# Altium project SFCslaver.PrjPCB
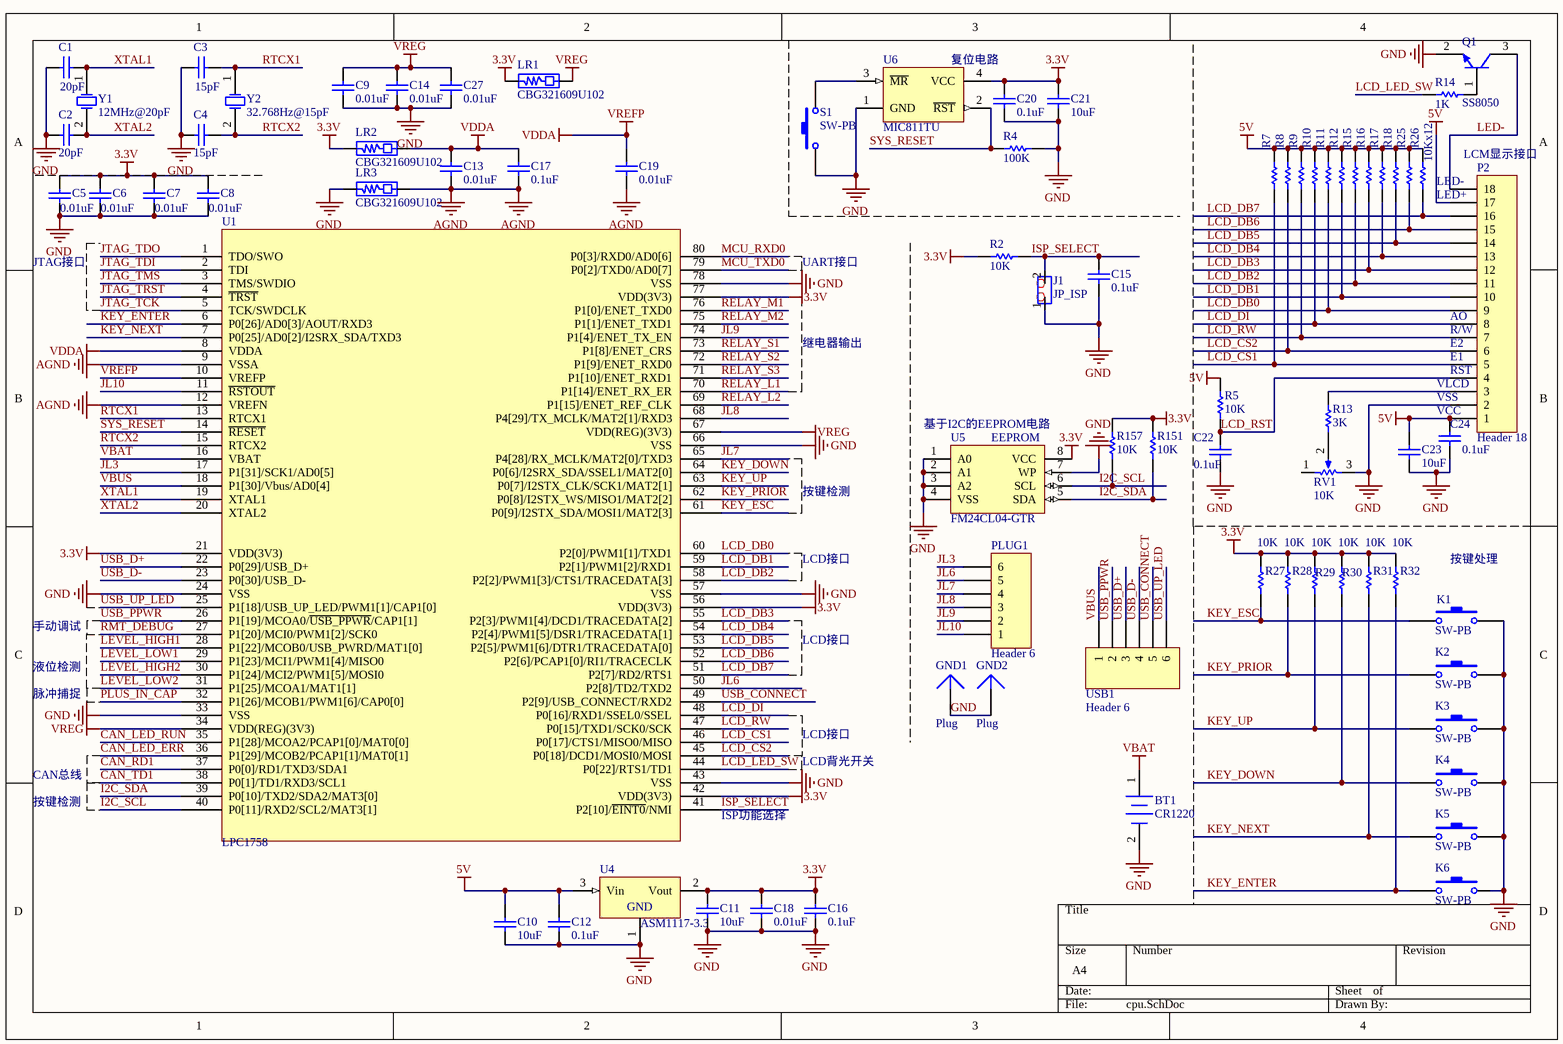
[diagram p0: cpu.SchDoc]
8 sheets, 284 parts. Net scope: global (net labels, ports and power ports of the same name join across sheets).
Board file: JKA-1.PcbDoc
Sheets:
  cpu.SchDoc
  input1.SchDoc
  input2.SchDoc
  input3.SchDoc
  output1.SchDoc
  output2.SchDoc
  output3.SchDoc
  xcomm.SchDoc

## Sheet cpu.SchDoc
size A4

### Parts
BT1  CR1220  [BAT-CR1220A]
C1  20pF  [CAPC2012M]
C2  20pF  [CAPC2012M]
C3  15pF  [CAPC2012M]
C4  15pF  [CAPC2012M]
C5  0.01uF  [CAPC2012M]
C6  0.01uF  [CAPC2012M]
C7  0.01uF  [CAPC2012M]
C8  0.01uF  [CAPC2012M]
C9  0.01uF  [CAPC2012M]
C10  10uF  [CAPC2012M]
C11  10uF  [CAPC2012M]
C12  0.1uF  [CAPC2012M]
C13  0.01uF  [CAPC2012M]
C14  0.01uF  [CAPC2012M]
C15  0.1uF  [CAPC2012M]
C16  0.1uF  [CAPC2012M]
C17  0.1uF  [CAPC2012M]
C18  0.01uF  [CAPC2012M]
C19  0.01uF  [CAPC2012M]
C20  0.1uF  [CAPC2012M]
C21  10uF  [CAPC2012M]
C22  0.1uF  [CAPC2012M]
C23  10uF  [CAPC2012M]
C24  0.1uF  [CAPC2012M]
C27  0.01uF  [CAPC2012M]
GND1  Plug  [PIN1]
GND2  Plug  [PIN1]
J1  JP_ISP  [DS-01]
K1  SW-PB  [PBST-4S]
K2  SW-PB  [PBST-4S]
K3  SW-PB  [PBST-4S]
K4  SW-PB  [PBST-4S]
K5  SW-PB  [PBST-4S]
K6  SW-PB  [PBST-4S]
LR1  CBG321609U102  [RESC3216M]
LR2  CBG321609U102  [RESC3216M]
LR3  CBG321609U102  [RESC3216M]
P2  Header 18  [HDR1X18]
PLUG1  Header 6  [HDR1X6]
Q1  SS8050  [SOT-23_N]
R2  10K  [RESC2012M]
R4  100K  [RESC2012M]
R5  10K  [RESC2012M]
R7  10K  [RESC2012M]  (value not drawn)
R8  10K  [RESC2012M]  (value not drawn)
R9  10K  [RESC2012M]  (value not drawn)
R10  10K  [RESC2012M]  (value not drawn)
R11  10K  [RESC2012M]  (value not drawn)
R12  10K  [RESC2012M]  (value not drawn)
R13  3K  [RESC2012M]
R14  1K  [RESC2012M]
R15  10K  [RESC2012M]  (value not drawn)
R16  10K  [RESC2012M]  (value not drawn)
R17  10K  [RESC2012M]  (value not drawn)
R18  10K  [RESC2012M]  (value not drawn)
R25  10K  [RESC2012M]  (value not drawn)
R26  10K  [RESC2012M]  (value not drawn)
R27  10K  [RESC2012M]
R28  10K  [RESC2012M]
R29  10K  [RESC2012M]
R30  10K  [RESC2012M]
R31  10K  [RESC2012M]
R32  10K  [RESC2012M]
R151  10K  [RESC2012M]
R157  10K  [RESC2012M]
RV1  10K  [VR5S]
S1  SW-PB  [DPST-4S]
U1  LPC1758  [LQFP80_M]
U4  ASM1117-3.3  [SOT-223]
U5  FM24CL04-GTR  [SO-8]
U6  MIC811TU  [SOT143_N]
USB1  Header 6  [HDR1X6]
Y1  12MHz@20pF  [HC_SOC]
Y2  32.768Hz@15pF  [HC-RTC]

### Nets
3.3V: C5.2 C6.2 C7.2 C8.2 C11.2 C16.2 C18.2 C20.2 C21.2 LR1.1 LR2.1 R2.1 R27.2 R28.2 R29.2 R30.2 R31.2 R32.2 R151.2 R157.1 U1.21(VDD(3V3)) U1.42(VDD(3V3)) U1.56(VDD(3V3)) U1.77(VDD(3V3)) U4.2(Vout) U5.8(VCC) U6.4(VCC)
5V: C10.2 C12.2 C23.2 C24.1 P2.1 P2.17 R5.1 R7.1 R8.1 R9.1 R10.1 R11.1 R12.1 R15.1 R16.1 R17.1 R18.1 R25.1 R26.1 U4.3(Vin)
AGND: C13.1 C17.1 C19.1 LR3.2 U1.9(VSSA) U1.12(VREFN)
GND: BT1.2(-) C1.2 C2.2 C3.2 C4.2 C5.1 C6.1 C7.1 C8.1 C9.1 C10.1 C11.1 C12.1 C14.1 C15.2 C16.1 C18.1 C20.1 C21.1 C22.2 C23.1 C24.2 C27.1 GND1.1 GND2.1 J1.1 K1.2 K2.2 K3.2 K4.2 K5.2 K6.2 LR3.1 P2.2 Q1.2(E) R4.2 RV1.3(BOT) S1.1 U1.24(VSS) U1.33(VSS) U1.43(VSS) U1.57(VSS) U1.66(VSS) U1.78(VSS) U4.1(GND) U5.1(A0) U5.2(A1) U5.3(A2) U5.4(VSS) U5.7(WP) U6.1(GND)
VBAT: BT1.1(+) U1.16(VBAT)
VREFP: C13.2 C17.2 C19.2 LR2.2 U1.8(VDDA) U1.10(VREFP)  [also labelled VDDA]
VREG: C9.2 C14.2 C27.2 LR1.2 U1.34(VDD(REG)(3V3)) U1.67(VDD(REG)(3V3))
CAN_LED_ERR: U1.36(P1[29]/MCOB2/PCAP1[1]/MAT0[1])
CAN_LED_RUN: U1.35(P1[28]/MCOA2/PCAP1[0]/MAT0[0])
CAN_RD1: U1.37(P0[0]/RD1/TXD3/SDA1)
CAN_TD1: U1.38(P0[1]/TD1/RXD3/SCL1)
I2C_SCL: R157.2 U1.40(P0[11]/RXD2/SCL2/MAT3[1]) U5.6(SCL)
I2C_SDA: R151.1 U1.39(P0[10]/TXD2/SDA2/MAT3[0]) U5.5(SDA)
ISP_SELECT: C15.1 J1.2 R2.2 U1.41(P2[10]/~{EINT0}/NMI)
JL3: PLUG1.6 U1.17(P1[31]/SCK1/AD0[5])
JL6: PLUG1.5 U1.50(P2[8]/TD2/TXD2)
JL7: PLUG1.4 U1.65(P4[28]/RX_MCLK/MAT2[0]/TXD3)
JL8: PLUG1.3 U1.68(P4[29]/TX_MCLK/MAT2[1]/RXD3)
JL9: PLUG1.2 U1.74(P1[4]/ENET_TX_EN)
JL10: PLUG1.1 U1.11(~{RSTOUT})
JTAG_TCK: U1.5(TCK/SWDCLK)
JTAG_TDI: U1.2(TDI)
JTAG_TDO: U1.1(TDO/SWO)
JTAG_TMS: U1.3(TMS/SWDIO)
JTAG_TRST: U1.4(~{TRST})
KEY_DOWN: K4.1 R30.1 U1.64(P0[6]/I2SRX_SDA/SSEL1/MAT2[0])
KEY_ENTER: K6.1 R32.1 U1.6(P0[26]/AD0[3]/AOUT/RXD3)
KEY_ESC: K1.1 R27.1 U1.61(P0[9]/I2STX_SDA/MOSI1/MAT2[3])
KEY_NEXT: K5.1 R31.1 U1.7(P0[25]/AD0[2]/I2SRX_SDA/TXD3)
KEY_PRIOR: K2.1 R28.1 U1.62(P0[8]/I2STX_WS/MISO1/MAT2[2])
KEY_UP: K3.1 R29.1 U1.63(P0[7]/I2STX_CLK/SCK1/MAT2[1])
LCD_CS1: P2.5 R7.2 U1.46(P0[17]/CTS1/MISO0/MISO)
LCD_CS2: P2.6 R8.2 U1.45(P0[18]/DCD1/MOSI0/MOSI)
LCD_DB0: P2.9 R11.2 U1.60(P2[0]/PWM1[1]/TXD1)
LCD_DB1: P2.10 R12.2 U1.59(P2[1]/PWM1[2]/RXD1)
LCD_DB2: P2.11 R15.2 U1.58(P2[2]/PWM1[3]/CTS1/TRACEDATA[3])
LCD_DB3: P2.12 R16.2 U1.55(P2[3]/PWM1[4]/DCD1/TRACEDATA[2])
LCD_DB4: P2.13 R17.2 U1.54(P2[4]/PWM1[5]/DSR1/TRACEDATA[1])
LCD_DB5: P2.14 R18.2 U1.53(P2[5]/PWM1[6]/DTR1/TRACEDATA[0])
LCD_DB6: P2.15 R25.2 U1.52(P2[6]/PCAP1[0]/RI1/TRACECLK)
LCD_DB7: P2.16 R26.2 U1.51(P2[7]/RD2/RTS1)
LCD_DI: P2.8 R10.2 U1.48(P0[16]/RXD1/SSEL0/SSEL)
LCD_LED_SW: R14.1 U1.44(P0[22]/RTS1/TD1)
LCD_RST: C22.1 P2.4 R5.2
LCD_RW: P2.7 R9.2 U1.47(P0[15]/TXD1/SCK0/SCK)
LED-: P2.18 Q1.3(C)
LEVEL_HIGH1: U1.28(P1[22]/MCOB0/USB_PWRD/MAT1[0])
LEVEL_HIGH2: U1.30(P1[24]/MCI2/PWM1[5]/MOSI0)
LEVEL_LOW1: U1.29(P1[23]/MCI1/PWM1[4]/MISO0)
LEVEL_LOW2: U1.31(P1[25]/MCOA1/MAT1[1])
MCU_RXD0: U1.80(P0[3]/RXD0/AD0[6])
MCU_TXD0: U1.79(P0[2]/TXD0/AD0[7])
PLUS_IN_CAP: U1.32(P1[26]/MCOB1/PWM1[6]/CAP0[0])
RELAY_L1: U1.70(P1[14]/ENET_RX_ER)
RELAY_L2: U1.69(P1[15]/ENET_REF_CLK)
RELAY_M1: U1.76(P1[0]/ENET_TXD0)
RELAY_M2: U1.75(P1[1]/ENET_TXD1)
RELAY_S1: U1.73(P1[8]/ENET_CRS)
RELAY_S2: U1.72(P1[9]/ENET_RXD0)
RELAY_S3: U1.71(P1[10]/ENET_RXD1)
RMT_DEBUG: U1.27(P1[20]/MCI0/PWM1[2]/SCK0)
RTCX1: C3.1 U1.13(RTCX1) Y2.1(OSC1)
RTCX2: C4.1 U1.15(RTCX2) Y2.2(OSC2)
SYS_RESET: R4.1 U1.14(~{RESET}) U6.2(~{RST})
USB_CONNECT: U1.49(P2[9]/USB_CONNECT/RXD2) USB1.5
USB_D+: U1.22(P0[29]/USB_D+) USB1.3
USB_D-: U1.23(P0[30]/USB_D-) USB1.4
USB_PPWR: U1.26(P1[19]/MCOA0/~{USB_PPWR}/CAP1[1]) USB1.2
USB_UP_LED: U1.25(P1[18]/USB_UP_LED/PWM1[1]/CAP1[0]) USB1.6
VBUS: U1.18(P1[30]/Vbus/AD0[4]) USB1.1
XTAL1: C1.1 U1.19(XTAL1) Y1.1(OSC1)
XTAL2: C2.1 U1.20(XTAL2) Y1.2(OSC2)
NetP2_3: P2.3 R13.2
NetQ1_1: Q1.1(B) R14.2
NetR13_1: R13.1 RV1.2(TAP)
NetS1_2: S1.2 U6.3(~{MR})

Not connected (* = marked no-connect by the designer): RV1 1(TOP)

### Notes on the sheet
- (near U6) 复位电路
- LED-
- (near R26) 10Kx12
- LCM显示接口
- LED+
- JTAG接口
- UART接口
- (near P2) AO
- 继电器输出
- (near P2) VLCD
- (near P2) R/W
- (near P2) E1
- (near P2) E2
- (near P2) RST
- (near U5) 基于I2C的EEPROM电路
- (near U5) EEPROM
- VSS
- VCC
- 按键检测
- LCD接口
- 按键处理
- 手动调试
- 脉冲捕捉
- 液位检测
- CAN总线
- LCD背光开关
- (near U1) ISP功能选择

### Library data of the parts
BT1 = Battery: Battery holder; Published: 24-Mar-1999; LatestRevisionDate: 17-Jul-2002; LatestRevisionNote: Re-released for DXP Platform.; PackageReference: BAT-2; Publisher: Altium Limited
C1-C4 = Cap: Capacitor; Value: 100pF; Published: 8-Jun-2000; LatestRevisionDate: 17-Jul-2002; LatestRevisionNote: Re-released for DXP Platform.; PackageReference: RAD-0.3; Publisher: Altium Limited
C5-C24 C27 = Cap: Capacitor; Value: 1nF; Published: 8-Jun-2000; LatestRevisionDate: 17-Jul-2002; LatestRevisionNote: Re-released for DXP Platform.; PackageReference: RAD-0.3; Publisher: Altium Limited
J1 = JK2H: Dial Switch pitch 7.62mm
K1-K6 = SW-PB: Push Button ,6mm(L)x6mm(W)x22mm(H); Published: 24-Mar-1999; LatestRevisionDate: 17-Jul-2002; LatestRevisionNote: Re-released for DXP Platform.; PackageReference: SPST-2; Publisher: Altium Limited
LR1-LR3 = BLM10/11/21/31/41: EMI FILTERS,DC Resistance max.0.05~1.5 ohms,10 ~ 1000 ohms at 100MHz  Frequency
P2 = Header 18H: 'Female Header,Single Row Straight, 20-Pin,Pitch 2.54mm,black; LatestRevisionDate: 17-Jul-2002; LatestRevisionNote: Re-released for DXP Platform.; Publisher: Altium Limited
PLUG1 USB1 = Header 6: Header, 6-Pin; LatestRevisionDate: 17-Jul-2002; LatestRevisionNote: Re-released for DXP Platform.; Publisher: Altium Limited
Q1 = PMMT491A: NPN BISS Transistor; Published: 17-Sep-2003; LatestRevisionDate: 12-Dec-2006; LatestRevisionNote: IPC-7351 Footprint Added.; DatasheetVersion: 11-Jun-2001; PackageVersion: May-1999; PackageReference: SOT23; Publisher: Altium Limited; PackageDescription: 3-Pin SOT-23 Package 0.95 mm Pitch, 2.3 mm Lead Span; ComponentLink1Description: Manufacturer Link; ComponentLink1URL: http://www.semiconductors.philips.com/; ComponentLink2Description: Datasheet; ComponentLink2URL: http://www.semiconductors.philips.com/acrobat/datasheets/PMMT491A_5.pdf
R2 R5 R7-R12 R15-R18 R25-R32 R151 R157 = Res1: Resistor; Published: 8-Jun-2000; LatestRevisionDate: 17-Jul-2002; LatestRevisionNote: Re-released for DXP Platform.; PackageReference: AXIAL-0.3; Publisher: Altium Limited; Value: 10K
R4 R13 R14 = Res1: Resistor; Value: 10K; Published: 8-Jun-2000; LatestRevisionDate: 17-Jul-2002; LatestRevisionNote: Re-released for DXP Platform.; PackageReference: AXIAL-0.3; Publisher: Altium Limited
RV1 = RPot-A: Potentiometer; Sim Note: Enter the Resistance value and the set point into parameter fields.; Set Position: 0.5; Value: 1K; Published: 8-Jun-2000; LatestRevisionDate: 17-Jul-2002; LatestRevisionNote: Re-released for DXP Platform.; PackageReference: VR5; Publisher: Altium Limited
S1 = SW-PB: Push Button ,2mm(L)x2mm(W)x10mm(H); Published: 24-Mar-1999; LatestRevisionDate: 17-Jul-2002; LatestRevisionNote: Re-released for DXP Platform.; PackageReference: SPST-2; Publisher: Altium Limited
U4 = LM1117T-5.0: 800mA Low-Dropout Linear Regulator
U5 = CAT24W02: Serial EEPROM
U6 = MAX811-EUS-T: 4-Pin 礟 Voltage Monitors with Manual Reset Input; Published: 16-Jan-2001; LatestRevisionDate: 29-May-2009; LatestRevisionNote: IPC-7351 Footprint Added.; DatasheetVersion: Feb-1998; PackageVersion: Feb-1998; PackageReference: SOT143; Publisher: Altium Limited; PackageDescription: 4-Pin SOT-143 Package 1.9 mm Pitch, 2.3 mm Lead Span; ComponentLink1Description: Manufacturer Link; ComponentLink1URL: http://www.maxim-ic.com/; ComponentLink2Description: Datasheet; ComponentLink2URL: http://pdfserv.maxim-ic.com/en/ds/MAX811-MAX812.pdf
Y1 Y2 = XTAL: Crystal Oscillator; Published: 8-Jun-2000; LatestRevisionDate: 17-Jul-2002; LatestRevisionNote: Re-released for DXP Platform.; PackageReference: R38; Publisher: Altium Limited
GND1 GND2 = Plug: LatestRevisionDate: 17-Jul-2002; LatestRevisionNote: Re-released for DXP Platform.; Publisher: Altium Limited

## Sheet input1.SchDoc
size A4
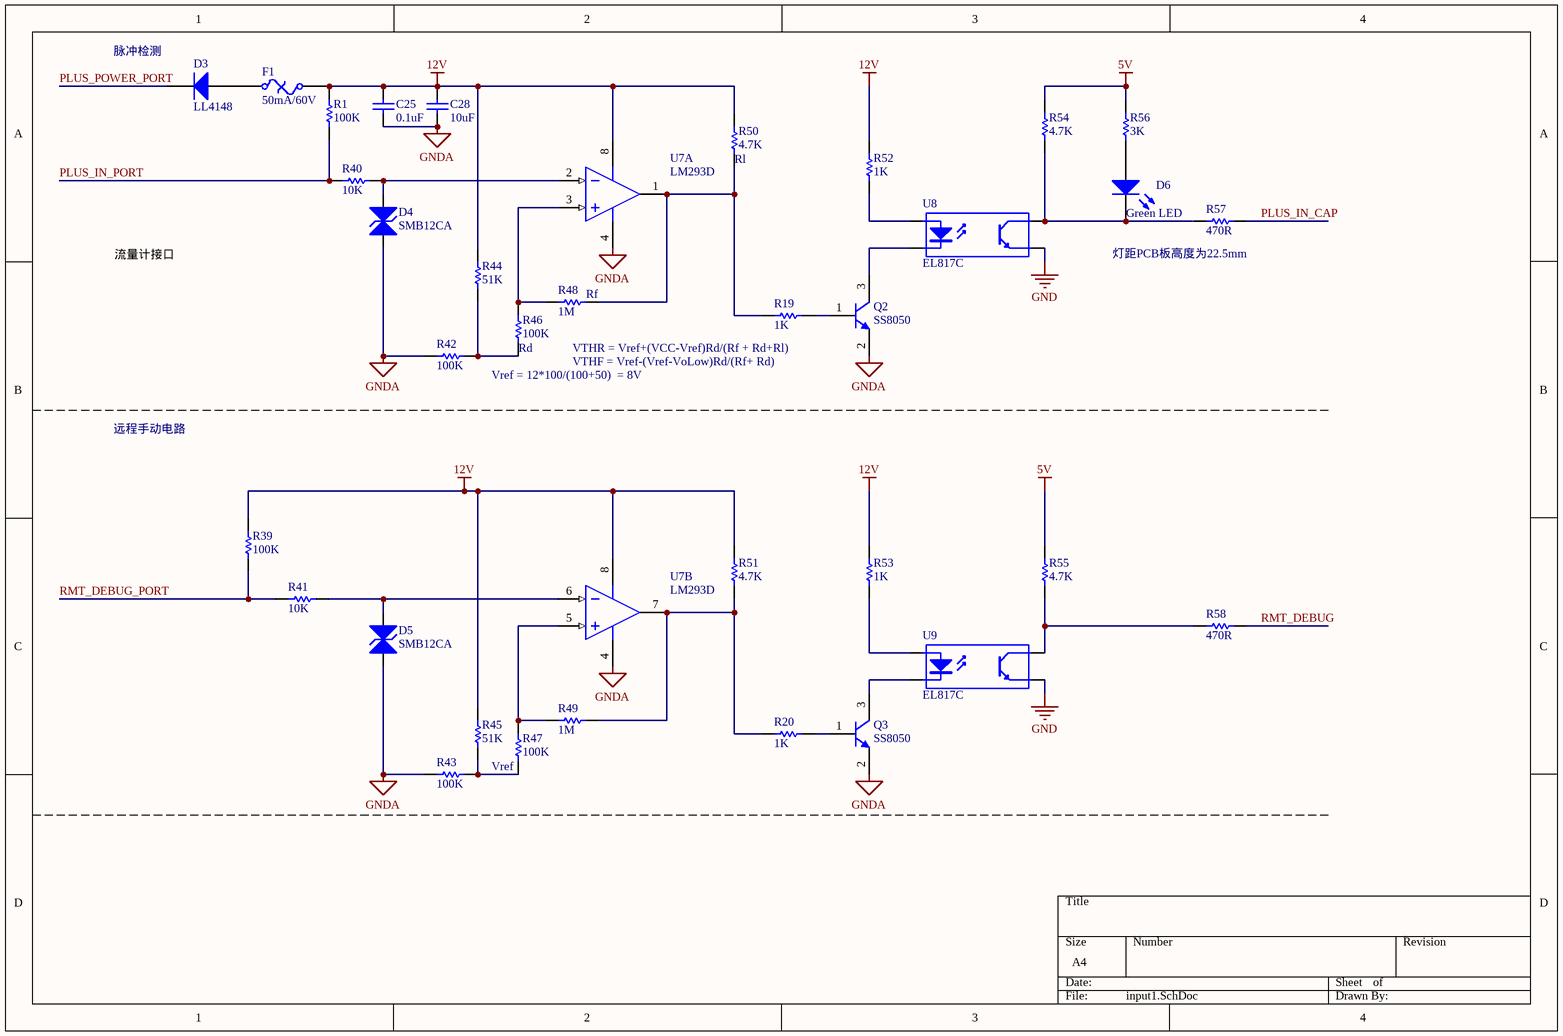
[diagram p1: input1.SchDoc]

### Parts
C25  0.1uF  [CAPC2012M]
C28  10uF  [CAPC2012M]
D3  LL4148  [CD3216-1206]
D4  SMB12CA  [SMB]
D5  SMB12CA  [SMB]
D6  Green LED  [LED254A]
F1  50mA/60V  [RESC3216M]
Q2  SS8050  [SOT-23_N]
Q3  SS8050  [SOT-23_N]
R1  100K  [RESC2012M]
R19  1K  [RESC2012M]
R20  1K  [RESC2012M]
R39  100K  [RESC2012M]
R40  10K  [RESC2012M]
R41  10K  [RESC2012M]
R42  100K  [RESC2012M]
R43  100K  [RESC2012M]
R44  51K  [RESC2012M]
R45  51K  [RESC2012M]
R46  100K  [RESC2012M]
R47  100K  [RESC2012M]
R48  1M  [RESC2012M]
R49  1M  [RESC2012M]
R50  4.7K  [RESC2012M]
R51  4.7K  [RESC2012M]
R52  1K  [RESC2012M]
R53  1K  [RESC2012M]
R54  4.7K  [RESC2012M]
R55  4.7K  [RESC2012M]
R56  3K  [RESC2012M]
R57  470R  [RESC2012M]
R58  470R  [RESC2012M]
U7  LM293D  [SO8_N]  (parts A,B of 2)
U8  EL817C  [SO-4LA]
U9  EL817C  [SO-4LA]

### Nets
5V: R54.2 R55.2 R56.1
12V: C25.2 C28.2 F1.2 R1.2 R39.2 R44.2 R45.2 R50.1 R51.2 R52.1 R53.1 U7.8(V+)
GND: U8.3(E) U9.3(E)
GNDA: C25.1 C28.1 D4.1(A) D5.1(A) Q2.2(E) Q3.2(E) R42.1 R43.1 U7.4(V-)
PLUS_IN_CAP: R57.2
PLUS_IN_PORT: R1.1 R40.2
PLUS_POWER_PORT: D3.2(K)
RMT_DEBUG: R58.2
RMT_DEBUG_PORT: R39.1 R41.2
NetD3_1: D3.1(A) F1.1
NetD4_2: D4.2(K) R40.1 U7.2(IN-)
NetD5_2: D5.2(K) R41.1 U7.6(IN-)
NetD6_1: D6.1(A) R56.2
NetD6_2: D6.2(K) R54.1 R57.1 U8.4(C)
NetQ2_1: Q2.1(B) R19.2
NetQ2_3: Q2.3(C) U8.2(K)
NetQ3_1: Q3.1(B) R20.2
NetQ3_3: Q3.3(C) U9.2(K)
NetR19_1: R19.1 R48.1 R50.2 U7.1(OUT)
NetR20_1: R20.1 R49.2 R51.1 U7.7(OUT)
NetR42_2: R42.2 R44.1 R46.1
NetR43_2: R43.2 R45.1 R47.1
NetR46_2: R46.2 R48.2 U7.3(IN+)
NetR47_2: R47.2 R49.1 U7.5(IN+)
NetR52_2: R52.2 U8.1(A)
NetR53_2: R53.2 U9.1(A)
NetR55_1: R55.1 R58.1 U9.4(C)

### Notes on the sheet
- 脉冲检测
- (near R50) Rl
- 流量计接口
- (near R48) Rf
- (near R57) 灯距PCB板高度为22.5mm
- Vref = 12*100/(100+50)  = 8V
- (near R46) Rd
- VTHR = Vref+(VCC-Vref)Rd/(Rf + Rd+Rl)
- VTHF = Vref-(Vref-VoLow)Rd/(Rf+ Rd)
- 远程手动电路
- (near R47) Vref

### Library data of the parts
C25 C28 = Cap: Capacitor; Value: 1nF; Published: 8-Jun-2000; LatestRevisionDate: 17-Jul-2002; LatestRevisionNote: Re-released for DXP Platform.; PackageReference: RAD-0.3; Publisher: Altium Limited
D3 = Diode 1N4007: 1 Amp General Purpose Rectifier; Published: 8-Jun-2000; LatestRevisionDate: 17-Jul-2002; LatestRevisionNote: Re-released for DXP Platform.; DatasheetVersion: 1998; PackageVersion: Aug-1999; PackageReference: DO-41; Publisher: Altium Limited; Code_JEDEC: DO-204-AL; ComponentLink1Description: Manufacturer Link; ComponentLink1URL: http://www.fairchildsemi.com/; ComponentLink2Description: Datasheet; ComponentLink2URL: http://www.fairchildsemi.com/ds/1N%2F1N4001.pdf
D4 D5 = Bi-dir TVS Diode: Published: 8-Jun-2000; LatestRevisionDate: 17-Jul-2002; LatestRevisionNote: Re-released for DXP Platform.; PackageReference: DIODE-0.7; Publisher: Altium Limited
D6 = LED1: Green LED ,SIP, Dia =3mm; Published: 8-Jun-2000; LatestRevisionDate: 08-Jul-2005; LatestRevisionNote: Mech Layer 1 removed.; PackageReference: LED-1; Publisher: Altium Limited
F1 = Fuse Thermal: Thermal Fuse; Published: 24-Mar-1999; LatestRevisionDate: 17-Jul-2002; LatestRevisionNote: Re-released for DXP Platform.; PackageReference: PIN-W2/E2.8; Publisher: Altium Limited; PackageDescription: Thru-Hole; 2 Leads
Q2 Q3 = PMMT491A: NPN BISS Transistor; Published: 17-Sep-2003; LatestRevisionDate: 12-Dec-2006; LatestRevisionNote: IPC-7351 Footprint Added.; DatasheetVersion: 11-Jun-2001; PackageVersion: May-1999; PackageReference: SOT23; Publisher: Altium Limited; PackageDescription: 3-Pin SOT-23 Package 0.95 mm Pitch, 2.3 mm Lead Span; ComponentLink1Description: Manufacturer Link; ComponentLink1URL: http://www.semiconductors.philips.com/; ComponentLink2Description: Datasheet; ComponentLink2URL: http://www.semiconductors.philips.com/acrobat/datasheets/PMMT491A_5.pdf
R1 R19 R20 R39 R42-R57 = Res1: Resistor; Value: 10K; Published: 8-Jun-2000; LatestRevisionDate: 17-Jul-2002; LatestRevisionNote: Re-released for DXP Platform.; PackageReference: AXIAL-0.3; Publisher: Altium Limited
R40 R41 = Res1: Resistor; Published: 8-Jun-2000; LatestRevisionDate: 17-Jul-2002; LatestRevisionNote: Re-released for DXP Platform.; PackageReference: AXIAL-0.3; Publisher: Altium Limited; Value: 10K
R58 = Res1: Resistor; Value: 470; Published: 8-Jun-2000; LatestRevisionDate: 17-Jul-2002; LatestRevisionNote: Re-released for DXP Platform.; PackageReference: AXIAL-0.3; Publisher: Altium Limited
U7 = LM393AD: Low-Power Dual Voltage Comparator; Published: 24-Aug-2001; LatestRevisionDate: 13-Apr-2006; LatestRevisionNote: IPC-7351 Footprint Added.; DatasheetVersion: Nov-1992; PackageVersion: Dec-2002; PackageReference: SO8; Publisher: Altium Limited; PackageDescription: 8-Pin Small Outline Integrated Circuit 1.27 mm Pitch; Code_JEDEC: MS-012-AA; Code_IPC: SOIC127P600-8; ComponentLink1Description: Manufacturer Link; ComponentLink1URL: http://www.st.com/; ComponentLink2Description: Datasheet; ComponentLink2URL: http://www.st.com/stonline/products/literature/ds/2164/lm193.pdf
U8 U9 = Optoisolator1: 4-Pin Phototransistor Optocoupler; Published: 24-Mar-1999; LatestRevisionDate: 04-Mar-2005; LatestRevisionNote: Sch pins 3 & 4 Swapped.; DatasheetVersion: Nov-2003; PackageReference: DIP-4; Publisher: Altium Limited

## Sheet input2.SchDoc
size A4
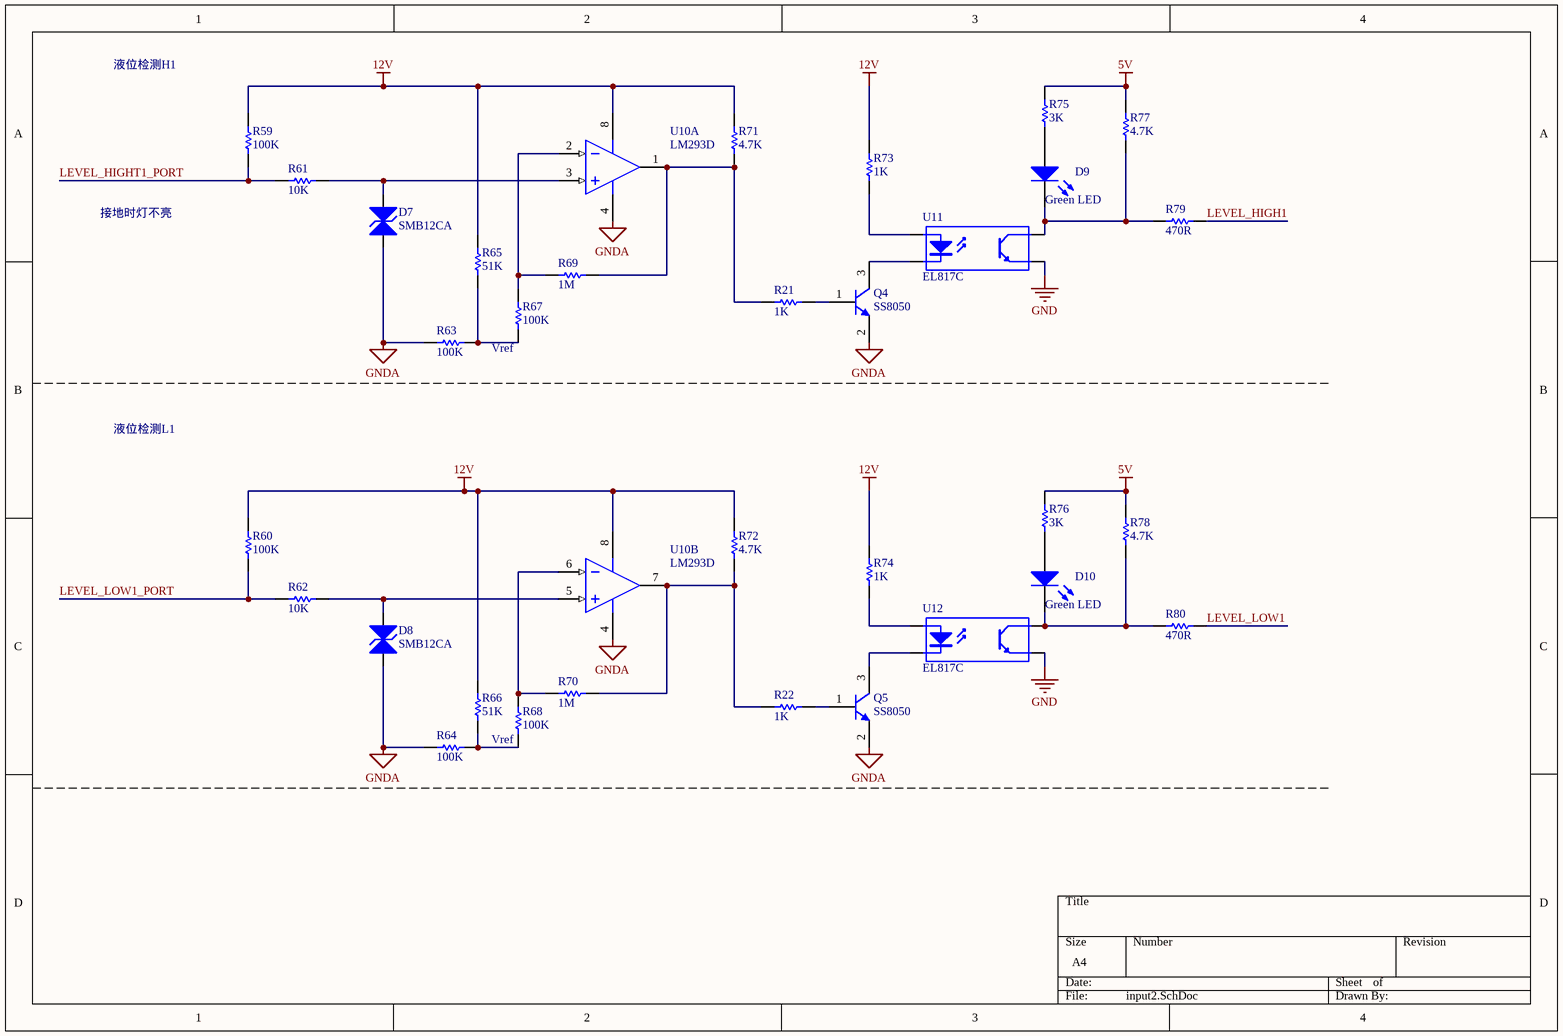
[diagram p2: input2.SchDoc]

### Parts
D7  SMB12CA  [SMB]
D8  SMB12CA  [SMB]
D9  Green LED  [LED254A]
D10  Green LED  [LED254A]
Q4  SS8050  [SOT-23_N]
Q5  SS8050  [SOT-23_N]
R21  1K  [RESC2012M]
R22  1K  [RESC2012M]
R59  100K  [RESC2012M]
R60  100K  [RESC2012M]
R61  10K  [RESC2012M]
R62  10K  [RESC2012M]
R63  100K  [RESC2012M]
R64  100K  [RESC2012M]
R65  51K  [RESC2012M]
R66  51K  [RESC2012M]
R67  100K  [RESC2012M]
R68  100K  [RESC2012M]
R69  1M  [RESC2012M]
R70  1M  [RESC2012M]
R71  4.7K  [RESC2012M]
R72  4.7K  [RESC2012M]
R73  1K  [RESC2012M]
R74  1K  [RESC2012M]
R75  3K  [RESC2012M]
R76  3K  [RESC2012M]
R77  4.7K  [RESC2012M]
R78  4.7K  [RESC2012M]
R79  470R  [RESC2012M]
R80  470R  [RESC2012M]
U10  LM293D  [SO8_N]  (parts A,B of 2)
U11  EL817C  [SO-4LA]
U12  EL817C  [SO-4LA]

### Nets
5V: R75.1 R76.1 R77.2 R78.2
12V: R59.2 R60.2 R65.2 R66.2 R71.1 R72.2 R73.2 R74.1 U10.8(V+)
GND: U11.3(E) U12.3(E)
GNDA: D7.1(A) D8.1(A) Q4.2(E) Q5.2(E) R63.1 R64.1 U10.4(V-)
LEVEL_HIGH1: R79.2
LEVEL_HIGHT1_PORT: R59.1 R61.2
LEVEL_LOW1: R80.2
LEVEL_LOW1_PORT: R60.1 R62.2
NetD7_2: D7.2(K) R61.1 U10.3(IN+)
NetD8_2: D8.2(K) R62.1 U10.5(IN+)
NetD9_1: D9.1(A) R75.2
NetD9_2: D9.2(K) R77.1 R79.1 U11.4(C)
NetD10_1: D10.1(A) R76.2
NetD10_2: D10.2(K) R78.1 R80.1 U12.4(C)
NetQ4_1: Q4.1(B) R21.2
NetQ4_3: Q4.3(C) U11.2(K)
NetQ5_1: Q5.1(B) R22.2
NetQ5_3: Q5.3(C) U12.2(K)
NetR21_1: R21.1 R69.2 R71.2 U10.1(OUT)
NetR22_1: R22.1 R70.2 R72.1 U10.7(OUT)
NetR63_2: R63.2 R65.1 R67.2
NetR64_2: R64.2 R66.1 R68.1
NetR67_1: R67.1 R69.1 U10.2(IN-)
NetR68_2: R68.2 R70.1 U10.6(IN-)
NetR73_1: R73.1 U11.1(A)
NetR74_2: R74.2 U12.1(A)

### Notes on the sheet
- 液位检测H1
- 接地时灯不亮
- (near R67) Vref
- 液位检测L1
- (near R68) Vref

### Library data of the parts
D7 D8 = Bi-dir TVS Diode: Published: 8-Jun-2000; LatestRevisionDate: 17-Jul-2002; LatestRevisionNote: Re-released for DXP Platform.; PackageReference: DIODE-0.7; Publisher: Altium Limited
D9 D10 = LED1: Green LED ,SIP, Dia =3mm; Published: 8-Jun-2000; LatestRevisionDate: 08-Jul-2005; LatestRevisionNote: Mech Layer 1 removed.; PackageReference: LED-1; Publisher: Altium Limited
Q4 Q5 = PMMT491A: NPN BISS Transistor; Published: 17-Sep-2003; LatestRevisionDate: 12-Dec-2006; LatestRevisionNote: IPC-7351 Footprint Added.; DatasheetVersion: 11-Jun-2001; PackageVersion: May-1999; PackageReference: SOT23; Publisher: Altium Limited; PackageDescription: 3-Pin SOT-23 Package 0.95 mm Pitch, 2.3 mm Lead Span; ComponentLink1Description: Manufacturer Link; ComponentLink1URL: http://www.semiconductors.philips.com/; ComponentLink2Description: Datasheet; ComponentLink2URL: http://www.semiconductors.philips.com/acrobat/datasheets/PMMT491A_5.pdf
R21 R22 R59 R60 R63-R80 = Res1: Resistor; Value: 10K; Published: 8-Jun-2000; LatestRevisionDate: 17-Jul-2002; LatestRevisionNote: Re-released for DXP Platform.; PackageReference: AXIAL-0.3; Publisher: Altium Limited
R61 R62 = Res1: Resistor; Published: 8-Jun-2000; LatestRevisionDate: 17-Jul-2002; LatestRevisionNote: Re-released for DXP Platform.; PackageReference: AXIAL-0.3; Publisher: Altium Limited; Value: 10K
U10 = LM393AD: Low-Power Dual Voltage Comparator; Published: 24-Aug-2001; LatestRevisionDate: 13-Apr-2006; LatestRevisionNote: IPC-7351 Footprint Added.; DatasheetVersion: Nov-1992; PackageVersion: Dec-2002; PackageReference: SO8; Publisher: Altium Limited; PackageDescription: 8-Pin Small Outline Integrated Circuit 1.27 mm Pitch; Code_JEDEC: MS-012-AA; Code_IPC: SOIC127P600-8; ComponentLink1Description: Manufacturer Link; ComponentLink1URL: http://www.st.com/; ComponentLink2Description: Datasheet; ComponentLink2URL: http://www.st.com/stonline/products/literature/ds/2164/lm193.pdf
U11 U12 = Optoisolator1: 4-Pin Phototransistor Optocoupler; Published: 24-Mar-1999; LatestRevisionDate: 04-Mar-2005; LatestRevisionNote: Sch pins 3 & 4 Swapped.; DatasheetVersion: Nov-2003; PackageReference: DIP-4; Publisher: Altium Limited

## Sheet input3.SchDoc
size A4
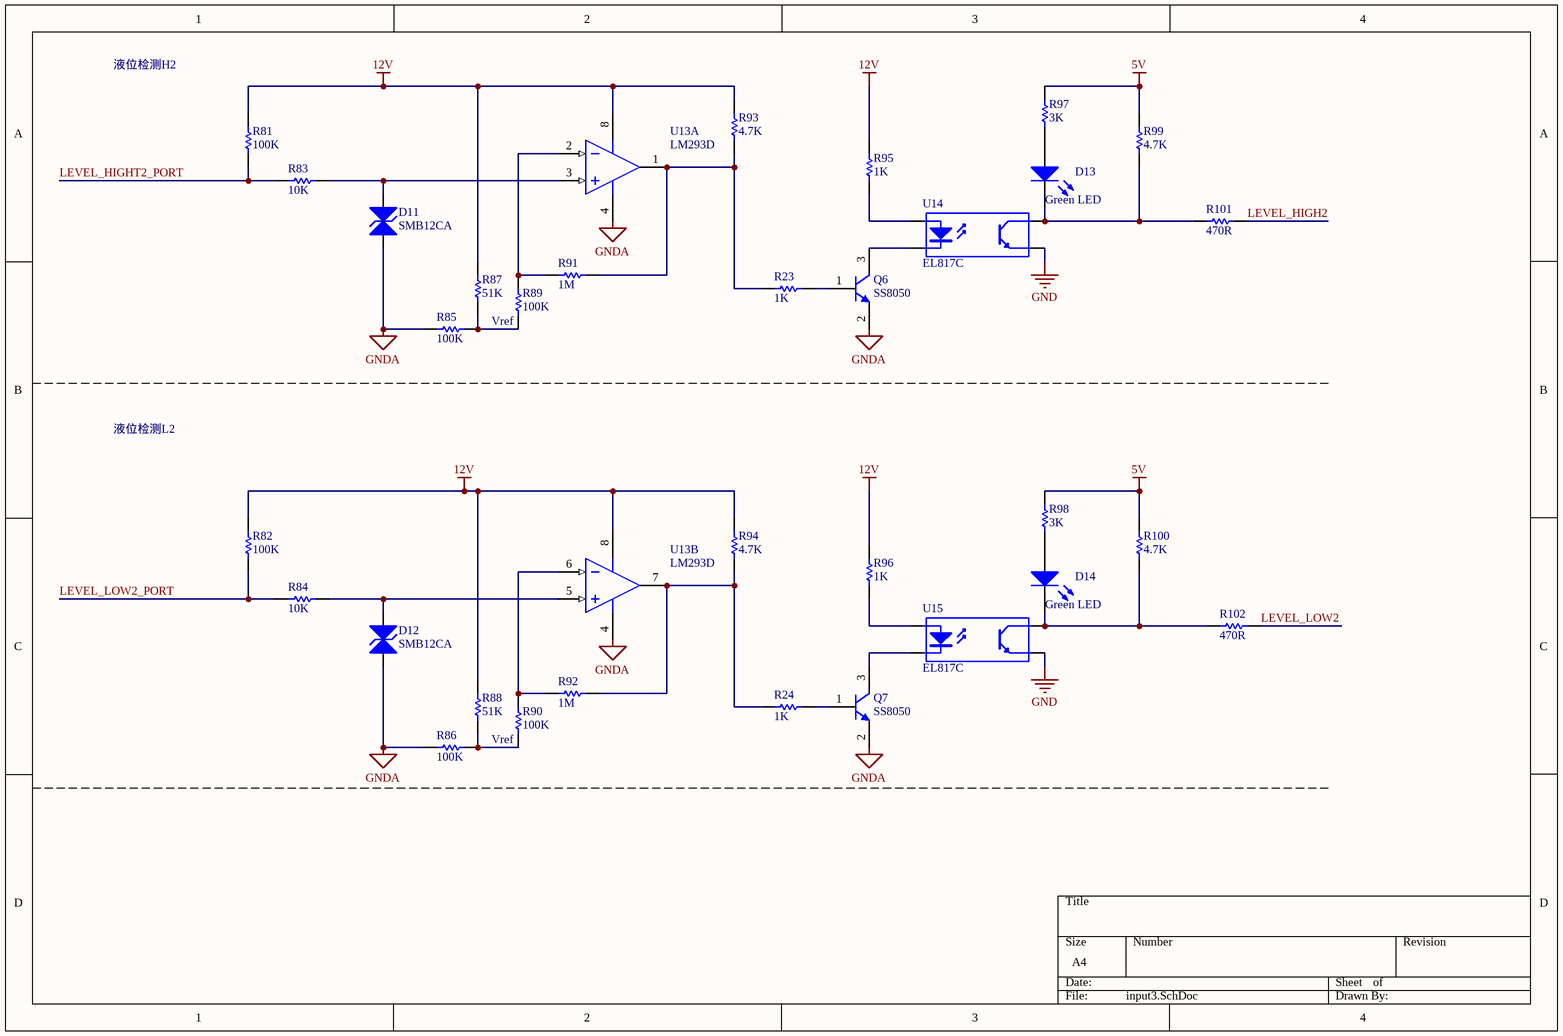
[diagram p3: input3.SchDoc]

### Parts
D11  SMB12CA  [SMB]
D12  SMB12CA  [SMB]
D13  Green LED  [LED254A]
D14  Green LED  [LED254A]
Q6  SS8050  [SOT-23_N]
Q7  SS8050  [SOT-23_N]
R23  1K  [RESC2012M]
R24  1K  [RESC2012M]
R81  100K  [RESC2012M]
R82  100K  [RESC2012M]
R83  10K  [RESC2012M]
R84  10K  [RESC2012M]
R85  100K  [RESC2012M]
R86  100K  [RESC2012M]
R87  51K  [RESC2012M]
R88  51K  [RESC2012M]
R89  100K  [RESC2012M]
R90  100K  [RESC2012M]
R91  1M  [RESC2012M]
R92  1M  [RESC2012M]
R93  4.7K  [RESC2012M]
R94  4.7K  [RESC2012M]
R95  1K  [RESC2012M]
R96  1K  [RESC2012M]
R97  3K  [RESC2012M]
R98  3K  [RESC2012M]
R99  4.7K  [RESC2012M]
R100  4.7K  [RESC2012M]
R101  470R  [RESC2012M]
R102  470R  [RESC2012M]
U13  LM293D  [SO8_N]  (parts A,B of 2)
U14  EL817C  [SO-4LA]
U15  EL817C  [SO-4LA]

### Nets
5V: R97.1 R98.1 R99.2 R100.2
12V: R81.2 R82.2 R87.2 R88.2 R93.1 R94.2 R95.1 R96.1 U13.8(V+)
GND: U14.3(E) U15.3(E)
GNDA: D11.1(A) D12.1(A) Q6.2(E) Q7.2(E) R85.1 R86.1 U13.4(V-)
LEVEL_HIGH2: R101.2
LEVEL_HIGHT2_PORT: R81.1 R83.2
LEVEL_LOW2: R102.2
LEVEL_LOW2_PORT: R82.1 R84.2
NetD11_2: D11.2(K) R83.1 U13.3(IN+)
NetD12_2: D12.2(K) R84.1 U13.5(IN+)
NetD13_1: D13.1(A) R97.2
NetD13_2: D13.2(K) R99.1 R101.1 U14.4(C)
NetD14_1: D14.1(A) R98.2
NetD14_2: D14.2(K) R100.1 R102.1 U15.4(C)
NetQ6_1: Q6.1(B) R23.2
NetQ6_3: Q6.3(C) U14.2(K)
NetQ7_1: Q7.1(B) R24.2
NetQ7_3: Q7.3(C) U15.2(K)
NetR23_1: R23.1 R91.2 R93.2 U13.1(OUT)
NetR24_1: R24.1 R92.2 R94.1 U13.7(OUT)
NetR85_2: R85.2 R87.1 R89.2
NetR86_2: R86.2 R88.1 R90.1
NetR89_1: R89.1 R91.1 U13.2(IN-)
NetR90_2: R90.2 R92.1 U13.6(IN-)
NetR95_2: R95.2 U14.1(A)
NetR96_2: R96.2 U15.1(A)

### Notes on the sheet
- 液位检测H2
- (near R89) Vref
- 液位检测L2
- (near R90) Vref

### Library data of the parts
D11 D12 = Bi-dir TVS Diode: Published: 8-Jun-2000; LatestRevisionDate: 17-Jul-2002; LatestRevisionNote: Re-released for DXP Platform.; PackageReference: DIODE-0.7; Publisher: Altium Limited
D13 D14 = LED1: Green LED ,SIP, Dia =3mm; Published: 8-Jun-2000; LatestRevisionDate: 08-Jul-2005; LatestRevisionNote: Mech Layer 1 removed.; PackageReference: LED-1; Publisher: Altium Limited
Q6 Q7 = PMMT491A: NPN BISS Transistor; Published: 17-Sep-2003; LatestRevisionDate: 12-Dec-2006; LatestRevisionNote: IPC-7351 Footprint Added.; DatasheetVersion: 11-Jun-2001; PackageVersion: May-1999; PackageReference: SOT23; Publisher: Altium Limited; PackageDescription: 3-Pin SOT-23 Package 0.95 mm Pitch, 2.3 mm Lead Span; ComponentLink1Description: Manufacturer Link; ComponentLink1URL: http://www.semiconductors.philips.com/; ComponentLink2Description: Datasheet; ComponentLink2URL: http://www.semiconductors.philips.com/acrobat/datasheets/PMMT491A_5.pdf
R23 R24 R81 R82 R85-R102 = Res1: Resistor; Value: 10K; Published: 8-Jun-2000; LatestRevisionDate: 17-Jul-2002; LatestRevisionNote: Re-released for DXP Platform.; PackageReference: AXIAL-0.3; Publisher: Altium Limited
R83 R84 = Res1: Resistor; Published: 8-Jun-2000; LatestRevisionDate: 17-Jul-2002; LatestRevisionNote: Re-released for DXP Platform.; PackageReference: AXIAL-0.3; Publisher: Altium Limited; Value: 10K
U13 = LM393AD: Low-Power Dual Voltage Comparator; Published: 24-Aug-2001; LatestRevisionDate: 13-Apr-2006; LatestRevisionNote: IPC-7351 Footprint Added.; DatasheetVersion: Nov-1992; PackageVersion: Dec-2002; PackageReference: SO8; Publisher: Altium Limited; PackageDescription: 8-Pin Small Outline Integrated Circuit 1.27 mm Pitch; Code_JEDEC: MS-012-AA; Code_IPC: SOIC127P600-8; ComponentLink1Description: Manufacturer Link; ComponentLink1URL: http://www.st.com/; ComponentLink2Description: Datasheet; ComponentLink2URL: http://www.st.com/stonline/products/literature/ds/2164/lm193.pdf
U14 U15 = Optoisolator1: 4-Pin Phototransistor Optocoupler; Published: 24-Mar-1999; LatestRevisionDate: 04-Mar-2005; LatestRevisionNote: Sch pins 3 & 4 Swapped.; DatasheetVersion: Nov-2003; PackageReference: DIP-4; Publisher: Altium Limited

## Sheet output1.SchDoc
size A4
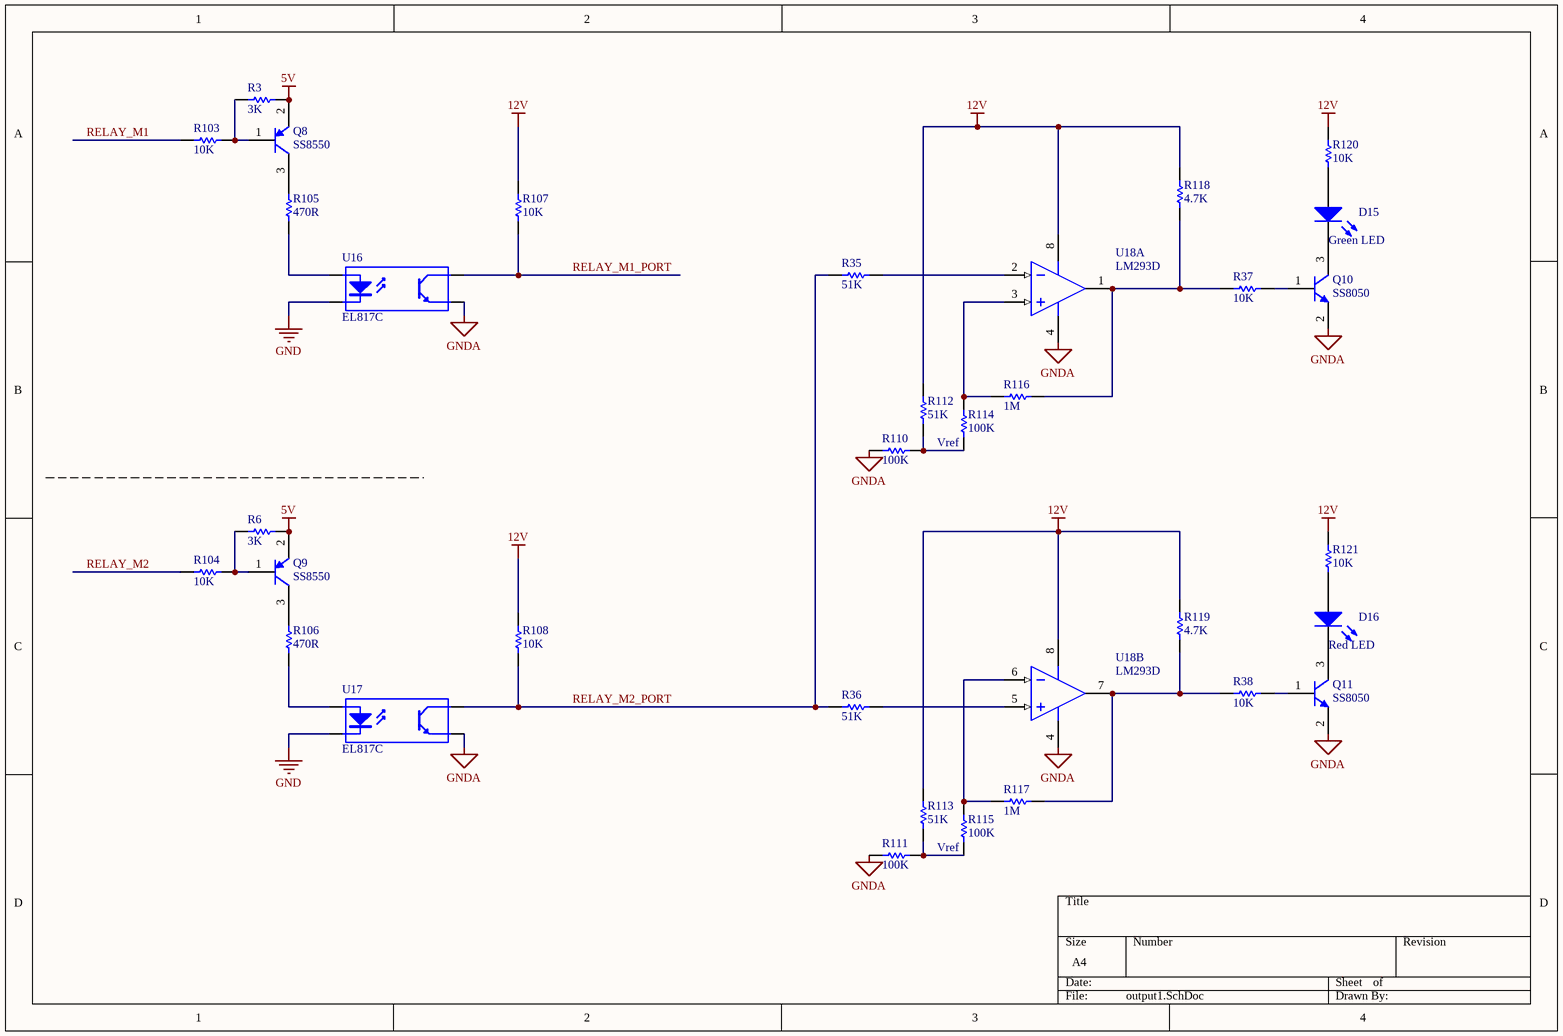
[diagram p4: output1.SchDoc]

### Parts
D15  Green LED  [LED254A]
D16  Red LED  [LED254A]
Q8  SS8550  [SOT-23_N]
Q9  SS8550  [SOT-23_N]
Q10  SS8050  [SOT-23_N]
Q11  SS8050  [SOT-23_N]
R3  3K  [RESC2012M]
R6  3K  [RESC2012M]
R35  51K  [RESC2012M]
R36  51K  [RESC2012M]
R37  10K  [RESC2012M]
R38  10K  [RESC2012M]
R103  10K  [RESC2012M]
R104  10K  [RESC2012M]
R105  470R  [RESC2012M]
R106  470R  [RESC2012M]
R107  10K  [RESC2012M]
R108  10K  [RESC2012M]
R110  100K  [RESC2012M]
R111  100K  [RESC2012M]
R112  51K  [RESC2012M]
R113  51K  [RESC2012M]
R114  100K  [RESC2012M]
R115  100K  [RESC2012M]
R116  1M  [RESC2012M]
R117  1M  [RESC2012M]
R118  4.7K  [RESC2012M]
R119  4.7K  [RESC2012M]
R120  10K  [RESC2012M]
R121  10K  [RESC2012M]
U16  EL817C  [SO-4LA]
U17  EL817C  [SO-4LA]
U18  LM293D  [SO8_N]  (parts A,B of 2)

### Nets
5V: Q8.2(E) Q9.2(E) R3.1 R6.1
12V: R107.2 R108.2 R112.2 R113.2 R118.1 R119.1 R120.2 R121.2 U18.8(V+)
GND: U16.2(K) U17.2(K)
GNDA: Q10.2(E) Q11.2(E) R110.1 R111.1 U16.3(E) U17.3(E) U18.4(V-)
RELAY_M1: R103.1
RELAY_M1_PORT: R107.1 U16.4(C)
RELAY_M2: R104.1
RELAY_M2_PORT: R35.1 R36.2 R108.1 U17.4(C)
NetD15_1: D15.1(A) R120.1
NetD15_2: D15.2(K) Q10.3(C)
NetD16_1: D16.1(A) R121.1
NetD16_2: D16.2(K) Q11.3(C)
NetQ8_1: Q8.1(B) R3.2 R103.2
NetQ8_3: Q8.3(C) R105.1
NetQ9_1: Q9.1(B) R6.2 R104.2
NetQ9_3: Q9.3(C) R106.1
NetQ10_1: Q10.1(B) R37.1
NetQ11_1: Q11.1(B) R38.2
NetR35_2: R35.2 U18.2(IN-)
NetR36_1: R36.1 U18.5(IN+)
NetR37_2: R37.2 R116.2 R118.2 U18.1(OUT)
NetR38_1: R38.1 R117.2 R119.2 U18.7(OUT)
NetR105_2: R105.2 U16.1(A)
NetR106_2: R106.2 U17.1(A)
NetR110_2: R110.2 R112.1 R114.2
NetR111_2: R111.2 R113.1 R115.2
NetR114_1: R114.1 R116.1 U18.3(IN+)
NetR115_1: R115.1 R117.1 U18.6(IN-)

### Notes on the sheet
- (near R114) Vref
- (near R115) Vref

### Library data of the parts
D15 = LED1: Green LED ,SIP, Dia =3mm; Published: 8-Jun-2000; LatestRevisionDate: 08-Jul-2005; LatestRevisionNote: Mech Layer 1 removed.; PackageReference: LED-1; Publisher: Altium Limited
D16 = LED1: Red LED ,SIP, Dia =3mm; Published: 8-Jun-2000; LatestRevisionDate: 08-Jul-2005; LatestRevisionNote: Mech Layer 1 removed.; PackageReference: LED-1; Publisher: Altium Limited
Q8 Q9 = 2N3906: PNP General Purpose Amplifier; Published: 8-Jun-2000; LatestRevisionDate: 15-Jan-2003; LatestRevisionNote: PCB Footprint 'BCY-W3/D4.7' replaced; DatasheetVersion: 1997; PackageVersion: Sep-1998; PackageReference: TO-92A; Publisher: Altium Limited; Code_JEDEC: TO-92A; ComponentLink1Description: Manufacturer Link; ComponentLink1URL: http://www.fairchildsemi.com/; ComponentLink2Description: Datasheet; ComponentLink2URL: http://www.fairchildsemi.com/ds/2N%2F2N3906.pdf
Q10 Q11 = PMMT491A: NPN BISS Transistor; Published: 17-Sep-2003; LatestRevisionDate: 12-Dec-2006; LatestRevisionNote: IPC-7351 Footprint Added.; DatasheetVersion: 11-Jun-2001; PackageVersion: May-1999; PackageReference: SOT23; Publisher: Altium Limited; PackageDescription: 3-Pin SOT-23 Package 0.95 mm Pitch, 2.3 mm Lead Span; ComponentLink1Description: Manufacturer Link; ComponentLink1URL: http://www.semiconductors.philips.com/; ComponentLink2Description: Datasheet; ComponentLink2URL: http://www.semiconductors.philips.com/acrobat/datasheets/PMMT491A_5.pdf
R3 R6 R35 R36 R105 R106 R110-R119 = Res1: Resistor; Value: 10K; Published: 8-Jun-2000; LatestRevisionDate: 17-Jul-2002; LatestRevisionNote: Re-released for DXP Platform.; PackageReference: AXIAL-0.3; Publisher: Altium Limited
R37 R38 R103 R104 R107 R108 R120 R121 = Res1: Resistor; Published: 8-Jun-2000; LatestRevisionDate: 17-Jul-2002; LatestRevisionNote: Re-released for DXP Platform.; PackageReference: AXIAL-0.3; Publisher: Altium Limited; Value: 10K
U16 U17 = Optoisolator1: 4-Pin Phototransistor Optocoupler; Published: 24-Mar-1999; LatestRevisionDate: 04-Mar-2005; LatestRevisionNote: Sch pins 3 & 4 Swapped.; DatasheetVersion: Nov-2003; PackageReference: DIP-4; Publisher: Altium Limited
U18 = LM293D: Low-Power Dual Voltage Comparator; Published: 24-Aug-2001; LatestRevisionDate: 13-Apr-2006; LatestRevisionNote: IPC-7351 Footprint Added.; DatasheetVersion: Jun-1998; PackageVersion: Dec-2002; PackageReference: SO8; Publisher: Altium Limited; PackageDescription: 8-Pin Small Outline Integrated Circuit 1.27 mm Pitch; Code_JEDEC: MS-012-AA; Code_IPC: SOIC127P600-8; ComponentLink1Description: Manufacturer Link; ComponentLink1URL: http://www.st.com/; ComponentLink2Description: Datasheet; ComponentLink2URL: http://www.st.com/stonline/products/literature/ds/2164/lm293.pdf

## Sheet output2.SchDoc
size A4
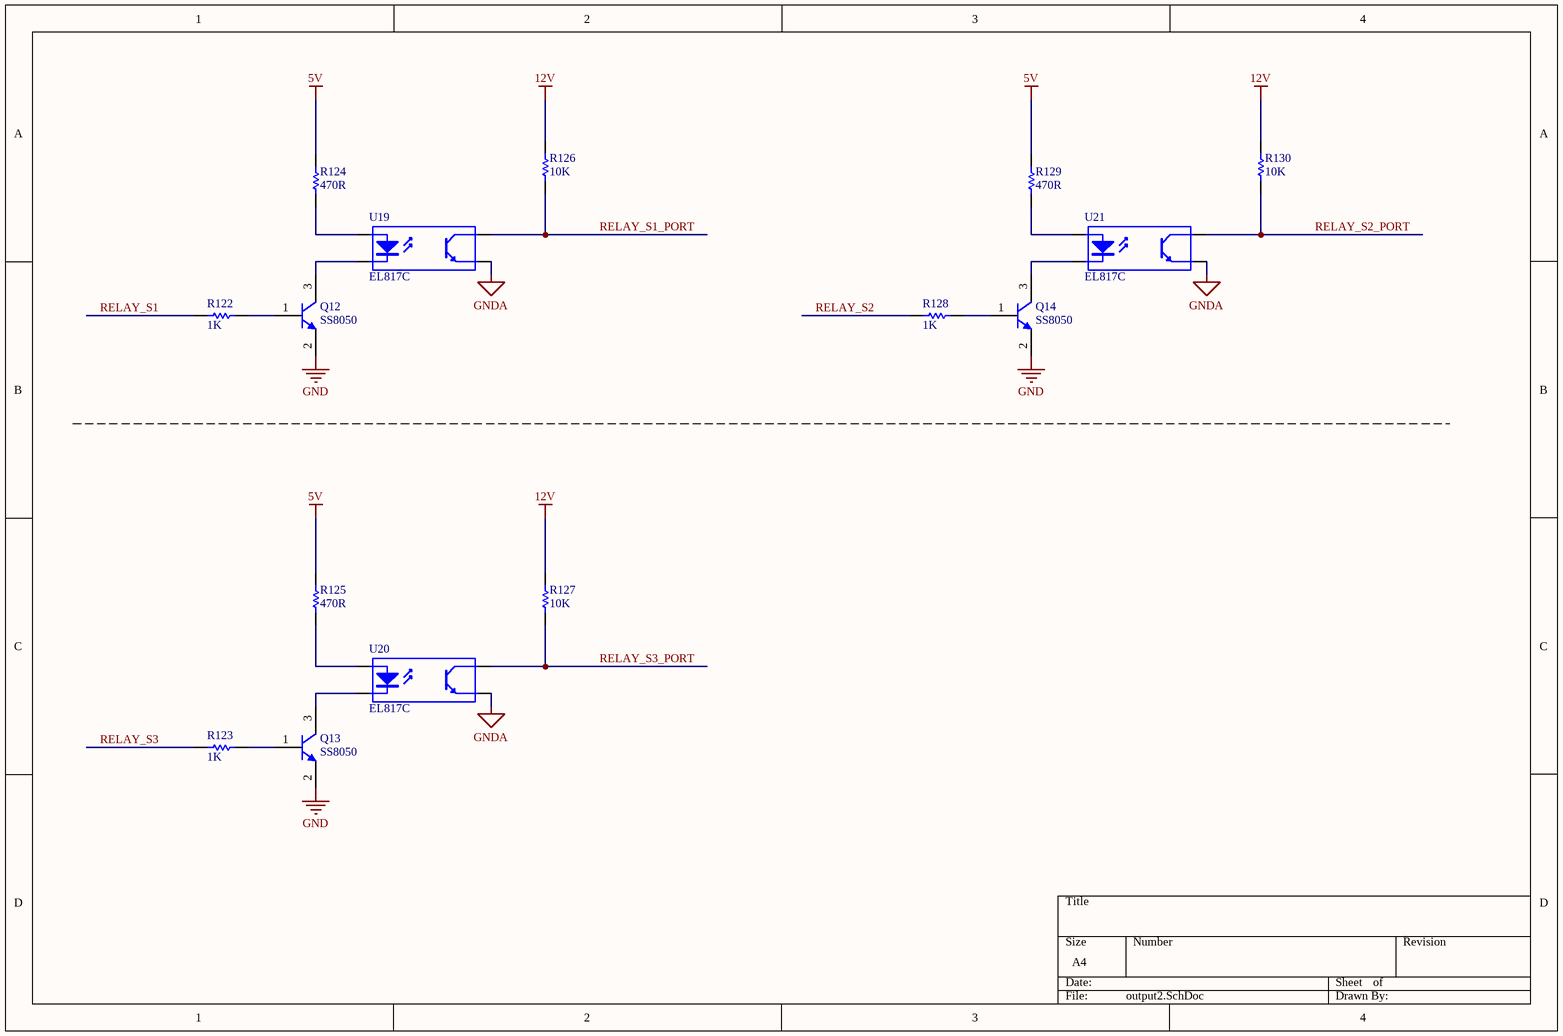
[diagram p5: output2.SchDoc]

### Parts
Q12  SS8050  [SOT-23_N]
Q13  SS8050  [SOT-23_N]
Q14  SS8050  [SOT-23_N]
R122  1K  [RESC2012M]
R123  1K  [RESC2012M]
R124  470R  [RESC2012M]
R125  470R  [RESC2012M]
R126  10K  [RESC2012M]
R127  10K  [RESC2012M]
R128  1K  [RESC2012M]
R129  470R  [RESC2012M]
R130  10K  [RESC2012M]
U19  EL817C  [SO-4LA]
U20  EL817C  [SO-4LA]
U21  EL817C  [SO-4LA]

### Nets
5V: R124.1 R125.1 R129.1
12V: R126.2 R127.2 R130.2
GND: Q12.2(E) Q13.2(E) Q14.2(E)
GNDA: U19.3(E) U20.3(E) U21.3(E)
RELAY_S1: R122.1
RELAY_S1_PORT: R126.1 U19.4(C)
RELAY_S2: R128.1
RELAY_S2_PORT: R130.1 U21.4(C)
RELAY_S3: R123.1
RELAY_S3_PORT: R127.1 U20.4(C)
NetQ12_1: Q12.1(B) R122.2
NetQ12_3: Q12.3(C) U19.2(K)
NetQ13_1: Q13.1(B) R123.2
NetQ13_3: Q13.3(C) U20.2(K)
NetQ14_1: Q14.1(B) R128.2
NetQ14_3: Q14.3(C) U21.2(K)
NetR124_2: R124.2 U19.1(A)
NetR125_2: R125.2 U20.1(A)
NetR129_2: R129.2 U21.1(A)

### Library data of the parts
Q12-Q14 = PMMT491A: NPN BISS Transistor; Published: 17-Sep-2003; LatestRevisionDate: 12-Dec-2006; LatestRevisionNote: IPC-7351 Footprint Added.; DatasheetVersion: 11-Jun-2001; PackageVersion: May-1999; PackageReference: SOT23; Publisher: Altium Limited; PackageDescription: 3-Pin SOT-23 Package 0.95 mm Pitch, 2.3 mm Lead Span; ComponentLink1Description: Manufacturer Link; ComponentLink1URL: http://www.semiconductors.philips.com/; ComponentLink2Description: Datasheet; ComponentLink2URL: http://www.semiconductors.philips.com/acrobat/datasheets/PMMT491A_5.pdf
R122-R125 R128 R129 = Res1: Resistor; Value: 10K; Published: 8-Jun-2000; LatestRevisionDate: 17-Jul-2002; LatestRevisionNote: Re-released for DXP Platform.; PackageReference: AXIAL-0.3; Publisher: Altium Limited
R126 R127 R130 = Res1: Resistor; Published: 8-Jun-2000; LatestRevisionDate: 17-Jul-2002; LatestRevisionNote: Re-released for DXP Platform.; PackageReference: AXIAL-0.3; Publisher: Altium Limited; Value: 10K
U19-U21 = Optoisolator1: 4-Pin Phototransistor Optocoupler; Published: 24-Mar-1999; LatestRevisionDate: 04-Mar-2005; LatestRevisionNote: Sch pins 3 & 4 Swapped.; DatasheetVersion: Nov-2003; PackageReference: DIP-4; Publisher: Altium Limited

## Sheet output3.SchDoc
size A4
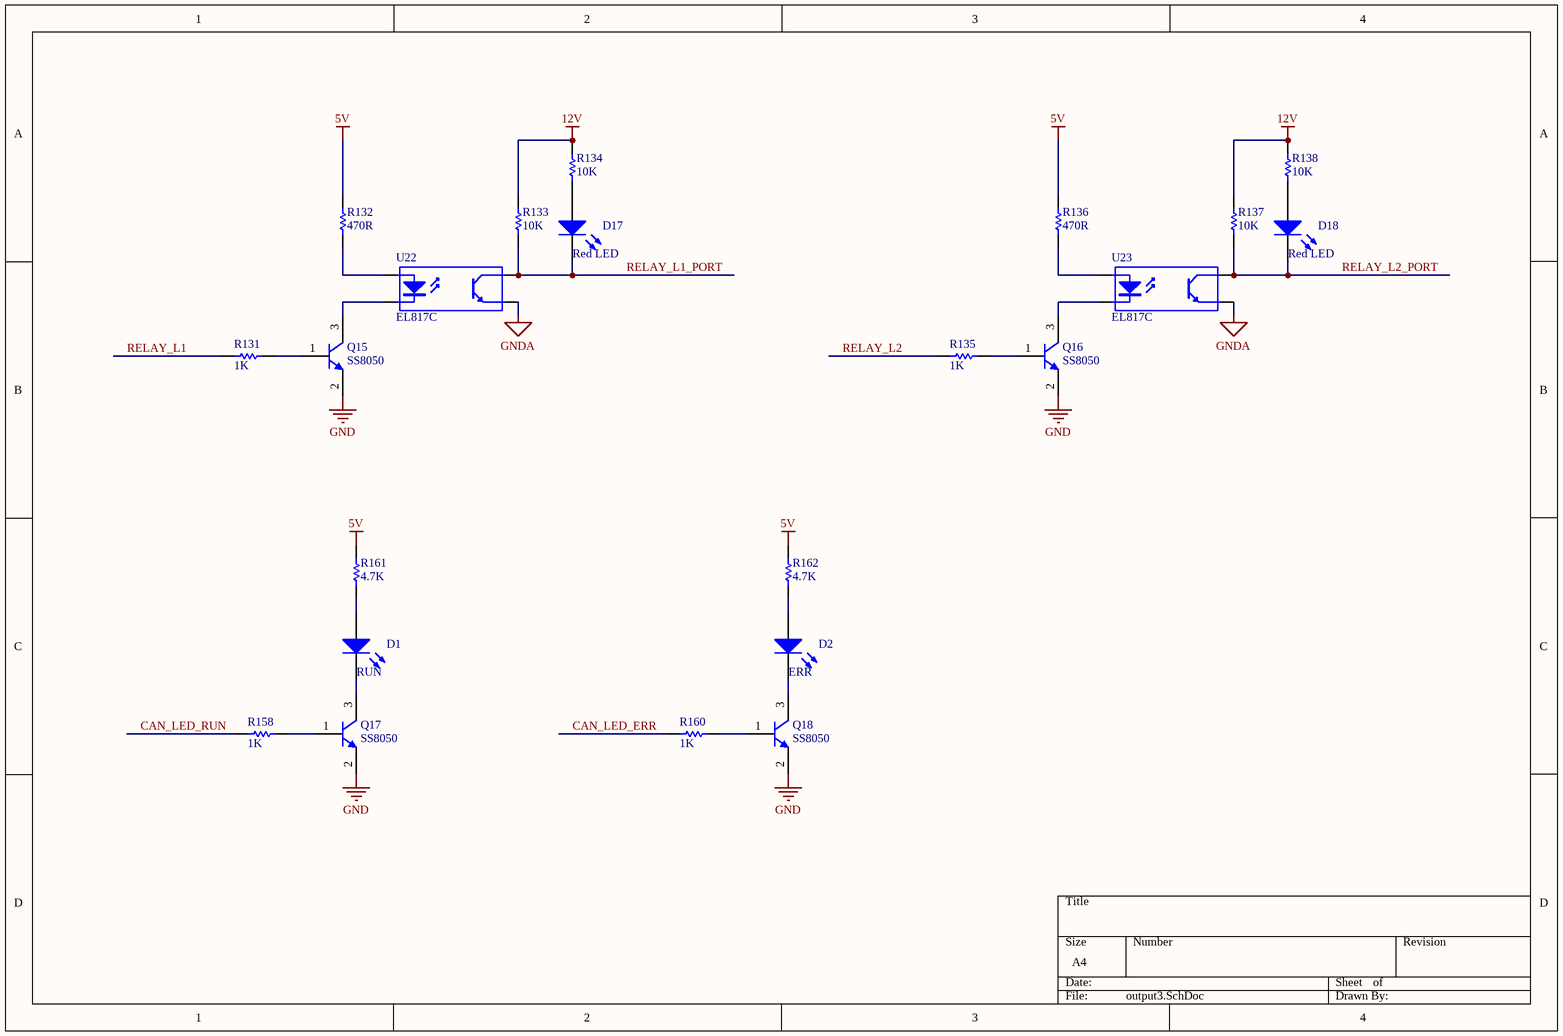
[diagram p6: output3.SchDoc]

### Parts
D1  RUN  [CD2012-0805]
D2  ERR  [CD2012-0805]
D17  Red LED  [LED254A]
D18  Red LED  [LED254A]
Q15  SS8050  [SOT-23_N]
Q16  SS8050  [SOT-23_N]
Q17  SS8050  [SOT-23_N]
Q18  SS8050  [SOT-23_N]
R131  1K  [RESC2012M]
R132  470R  [RESC2012M]
R133  10K  [RESC2012M]
R134  10K  [RESC2012M]
R135  1K  [RESC2012M]
R136  470R  [RESC2012M]
R137  10K  [RESC2012M]
R138  10K  [RESC2012M]
R158  1K  [RESC2012M]
R160  1K  [RESC2012M]
R161  4.7K  [RESC2012M]
R162  4.7K  [RESC2012M]
U22  EL817C  [SO-4LA]
U23  EL817C  [SO-4LA]

### Nets
5V: R132.1 R136.1 R161.1 R162.1
12V: R133.2 R134.1 R137.2 R138.1
GND: Q15.2(E) Q16.2(E) Q17.2(E) Q18.2(E)
GNDA: U22.3(E) U23.3(E)
CAN_LED_ERR: R160.1
CAN_LED_RUN: R158.1
RELAY_L1: R131.1
RELAY_L1_PORT: D17.2(K) R133.1 U22.4(C)
RELAY_L2: R135.1
RELAY_L2_PORT: D18.2(K) R137.1 U23.4(C)
NetD1_1: D1.1(A) R161.2
NetD1_2: D1.2(K) Q17.3(C)
NetD2_1: D2.1(A) R162.2
NetD2_2: D2.2(K) Q18.3(C)
NetD17_1: D17.1(A) R134.2
NetD18_1: D18.1(A) R138.2
NetQ15_1: Q15.1(B) R131.2
NetQ15_3: Q15.3(C) U22.2(K)
NetQ16_1: Q16.1(B) R135.2
NetQ16_3: Q16.3(C) U23.2(K)
NetQ17_1: Q17.1(B) R158.2
NetQ18_1: Q18.1(B) R160.2
NetR132_2: R132.2 U22.1(A)
NetR136_2: R136.2 U23.1(A)

### Library data of the parts
D1 = LED1: Green LED,Can bus indicator for run status.; Published: 8-Jun-2000; LatestRevisionDate: 08-Jul-2005; LatestRevisionNote: Mech Layer 1 removed.; PackageReference: LED-1; Publisher: Altium Limited
D2 = LED1: Red LED,Can bus indicator for err status.; Published: 8-Jun-2000; LatestRevisionDate: 08-Jul-2005; LatestRevisionNote: Mech Layer 1 removed.; PackageReference: LED-1; Publisher: Altium Limited
D17 D18 = LED1: Red LED ,SIP, Dia =3mm; Published: 8-Jun-2000; LatestRevisionDate: 08-Jul-2005; LatestRevisionNote: Mech Layer 1 removed.; PackageReference: LED-1; Publisher: Altium Limited
Q15-Q18 = PMMT491A: NPN BISS Transistor; Published: 17-Sep-2003; LatestRevisionDate: 12-Dec-2006; LatestRevisionNote: IPC-7351 Footprint Added.; DatasheetVersion: 11-Jun-2001; PackageVersion: May-1999; PackageReference: SOT23; Publisher: Altium Limited; PackageDescription: 3-Pin SOT-23 Package 0.95 mm Pitch, 2.3 mm Lead Span; ComponentLink1Description: Manufacturer Link; ComponentLink1URL: http://www.semiconductors.philips.com/; ComponentLink2Description: Datasheet; ComponentLink2URL: http://www.semiconductors.philips.com/acrobat/datasheets/PMMT491A_5.pdf
R131 R132 R135 R136 R158 R160-R162 = Res1: Resistor; Value: 10K; Published: 8-Jun-2000; LatestRevisionDate: 17-Jul-2002; LatestRevisionNote: Re-released for DXP Platform.; PackageReference: AXIAL-0.3; Publisher: Altium Limited
R133 R134 R137 R138 = Res1: Resistor; Published: 8-Jun-2000; LatestRevisionDate: 17-Jul-2002; LatestRevisionNote: Re-released for DXP Platform.; PackageReference: AXIAL-0.3; Publisher: Altium Limited; Value: 10K
U22 U23 = Optoisolator1: 4-Pin Phototransistor Optocoupler; Published: 24-Mar-1999; LatestRevisionDate: 04-Mar-2005; LatestRevisionNote: Sch pins 3 & 4 Swapped.; DatasheetVersion: Nov-2003; PackageReference: DIP-4; Publisher: Altium Limited

## Sheet xcomm.SchDoc
size A4
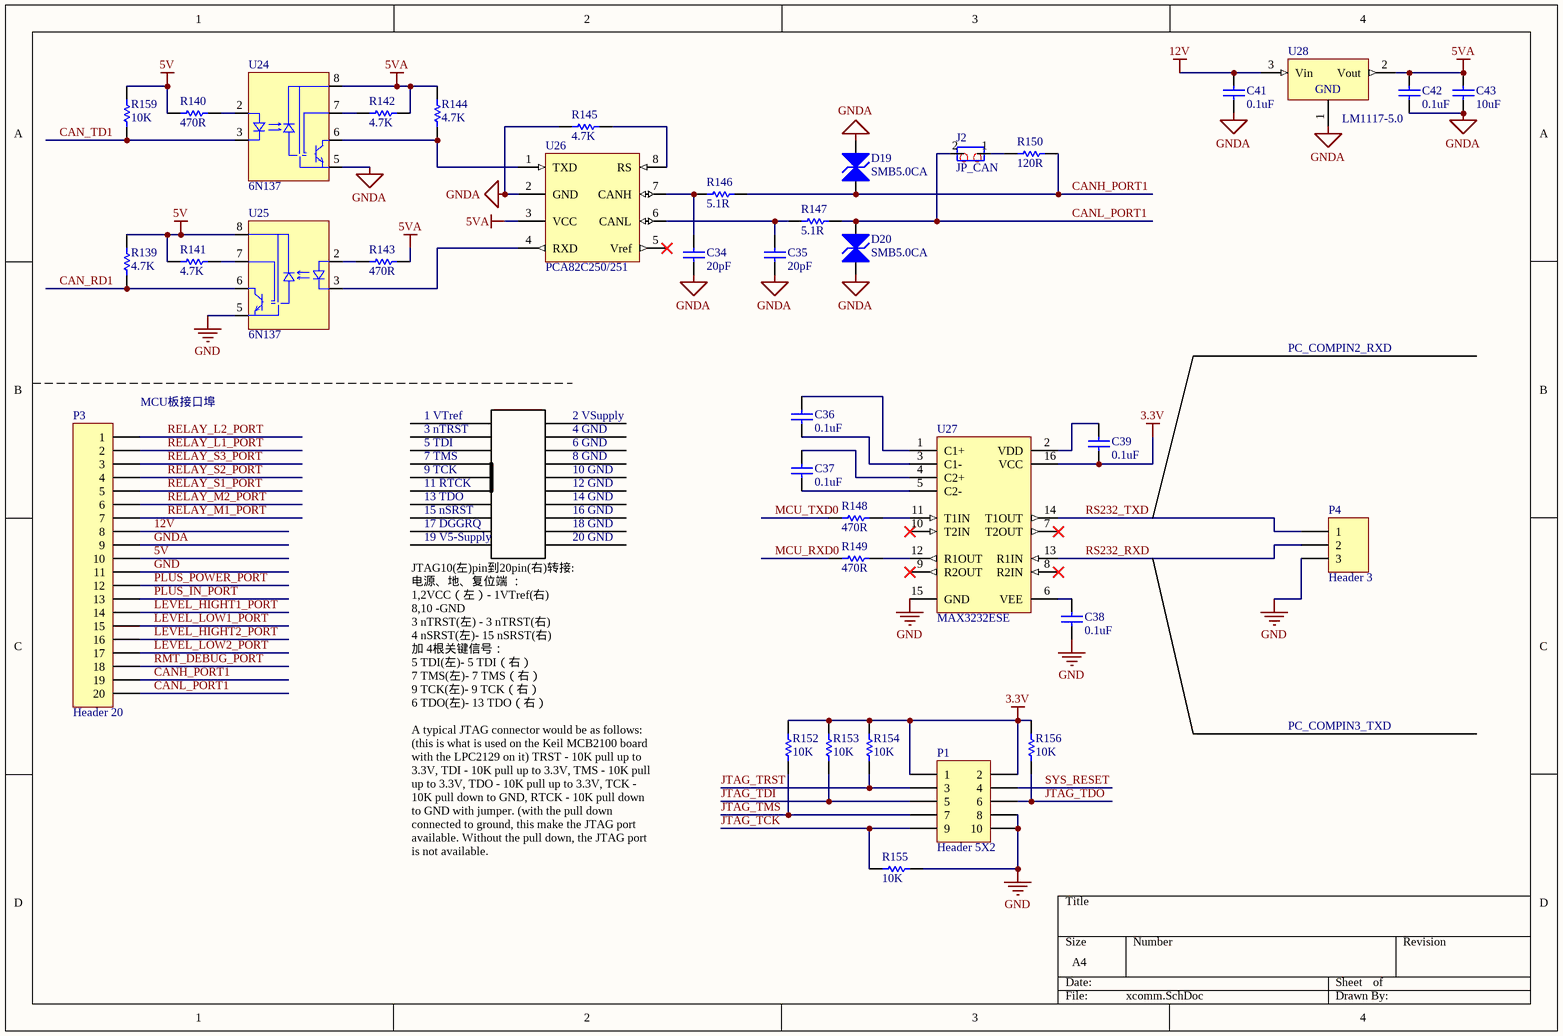
[diagram p7: xcomm.SchDoc]

### Parts
C34  20pF  [CAPC2012M]
C35  20pF  [CAPC2012M]
C36  0.1uF  [CAPC2012M]
C37  0.1uF  [CAPC2012M]
C38  0.1uF  [CAPC2012M]
C39  0.1uF  [CAPC2012M]
C41  0.1uF  [CAPC2012M]
C42  0.1uF  [CAPC2012M]
C43  10uF  [CAPC2012M]
D19  SMB5.0CA  [SMB]
D20  SMB5.0CA  [SMB]
J2  JP_CAN  [DS-01]
P1  Header 5X2  [HDR2X5M]
P3  Header 20  [HDR1X20-2.5]
P4  Header 3  [HDR1X3-2.5]
R139  4.7K  [RESC2012M]
R140  470R  [RESC2012M]
R141  4.7K  [RESC2012M]
R142  4.7K  [RESC2012M]
R143  470R  [RESC2012M]
R144  4.7K  [RESC2012M]
R145  4.7K  [RESC2012M]
R146  5.1R  [RESC2012M]
R147  5.1R  [RESC2012M]
R148  470R  [RESC2012M]
R149  470R  [RESC2012M]
R150  120R  [RESC2012M]
R152  10K  [RESC2012M]
R153  10K  [RESC2012M]
R154  10K  [RESC2012M]
R155  10K  [RESC2012M]
R156  10K  [RESC2012M]
R159  10K  [RESC2012M]
U24  6N137  [SO-8LA]
U25  6N137  [SO-8LA]
U26  PCA82C250/251  [SO8]
U27  MAX3232ESE  [NSO16_N]
U28  LM1117-5.0  [SOT-223]

### Nets
3.3V: C39.2 P1.1 P1.2 R152.2 R153.2 R154.2 R156.2 U27.16(VCC)
5V: P3.10 R139.1 R140.2 R141.1 R159.1 U25.8(VCC)
5VA: C42.2 C43.2 R142.1 R143.2 R144.1 U24.8(VCC) U26.3(VCC) U28.2(Vout)
12V: C41.2 P3.8 U28.3(Vin)
GND: C38.1 P1.8 P1.10 P3.11 P4.3 R155.2 U25.5(GND) U27.15(GND)
GNDA: C34.1 C35.1 C41.1 C42.1 C43.1 D19.1(A) D20.1(A) P3.9 R145.1 U24.5(GND) U26.2(GND) U28.1(GND)
CAN_RD1: R139.2 U25.6(Vo)
CAN_TD1: R159.2 U24.3(K)
CANH_PORT1: D19.2(K) P3.19 R146.1 R150.2
CANL_PORT1: D20.2(K) J2.2 P3.20 R147.1
JTAG_TCK: P1.9 R155.1
JTAG_TDI: P1.5 R153.1
JTAG_TDO: P1.6 R156.1
JTAG_TMS: P1.7 R152.1
JTAG_TRST: P1.3 R154.1
LEVEL_HIGHT1_PORT: P3.14
LEVEL_HIGHT2_PORT: P3.16
LEVEL_LOW1_PORT: P3.15
LEVEL_LOW2_PORT: P3.17
MCU_RXD0: R149.1
MCU_TXD0: R148.1
PLUS_IN_PORT: P3.13
PLUS_POWER_PORT: P3.12
RELAY_L1_PORT: P3.2
RELAY_L2_PORT: P3.1
RELAY_M1_PORT: P3.7
RELAY_M2_PORT: P3.6
RELAY_S1_PORT: P3.5
RELAY_S2_PORT: P3.4
RELAY_S3_PORT: P3.3
RMT_DEBUG_PORT: P3.18
RS232_RXD: P4.2 U27.13(R1IN)
RS232_TXD: P4.1 U27.14(T1OUT)
SYS_RESET: P1.4
NetC34_2: C34.2 R146.2 U26.7(CANH)
NetC35_2: C35.2 R147.2 U26.6(CANL)
NetC36_1: C36.1 U27.3(C1-)
NetC36_2: C36.2 U27.1(C1+)
NetC37_1: C37.1 U27.5(C2-)
NetC37_2: C37.2 U27.4(C2+)
NetC38_2: C38.2 U27.6(VEE)
NetC39_1: C39.1 U27.2(VDD)
NetJ2_1: J2.1 R150.1
NetR140_1: R140.1 U24.2(A)
NetR141_2: R141.2 U25.7(Ve)
NetR142_2: R142.2 U24.7(Ve)
NetR143_1: R143.1 U25.2(A)
NetR144_2: R144.2 U24.6(Vo) U26.1(TXD)
NetR145_2: R145.2 U26.8(RS)
NetR148_2: R148.2 U27.11(T1IN)
NetR149_2: R149.2 U27.12(R1OUT)
NetU25_3: U25.3(K) U26.4(RXD)

Not connected (* = marked no-connect by the designer): U26 5(Vref)*; U27 7(T2OUT)* 8(R2IN)* 9(R2OUT)* 10(T2IN)*

### Notes on the sheet
- PC_COMPIN2_RXD
- (near P3) MCU板接口埠
- 1 VTref
- 3 nTRST
- 5 TDI
- 2 VSupply
- 4 GND
- 6 GND
- 7 TMS
- 9 TCK
- 11 RTCK
- 13 TDO
- 15 nSRST
- 8 GND
- 10 GND
- 12 GND
- 14 GND
- 16 GND
- 17 DGGRQ
- 19 V5-Supply
- 18 GND
- 20 GND
- JTAG10(左)pin到20pin(右)转接:
  电源、地、复位端 ：
  1,2VCC（左）- 1VTref(右)
  8,10 -GND
  3 nTRST(左) - 3 nTRST(右)
  4 nSRST(左)- 15 nSRST(右)
  加 4根关键信号：
  5 TDI(左)- 5 TDI（右）
  7 TMS(左)- 7 TMS（右）
  9 TCK(左)- 9 TCK（右）
  6 TDO(左)- 13 TDO（右）
- PC_COMPIN3_TXD
- A typical JTAG connector would be as follows: (this is what is used on the Keil MCB2100 board with the LPC2129 on it) TRST - 10K pull up to 3.3V, TDI - 10K pull up to 3.3V, TMS - 10K pull up to 3.3V, TDO - 10K pull up to 3.3V, TCK - 10K pull down to GND, RTCK - 10K pull down to GND with jumper. (with the pull down connected to ground, this make the JTAG port available. Without the pull down, the JTAG port is not available.

### Library data of the parts
C34-C39 C41-C43 = Cap: Capacitor; Value: 1nF; Published: 8-Jun-2000; LatestRevisionDate: 17-Jul-2002; LatestRevisionNote: Re-released for DXP Platform.; PackageReference: RAD-0.3; Publisher: Altium Limited
D19 D20 = Bi-dir TVS Diode: Published: 8-Jun-2000; LatestRevisionDate: 17-Jul-2002; LatestRevisionNote: Re-released for DXP Platform.; PackageReference: DIODE-0.7; Publisher: Altium Limited
J2 = JK2H: 'Dial Switch pitch 7.62mm
P1 = Header 5X2: Header, 5-Pin, Dual row,Pitch 2mm; LatestRevisionDate: 17-Jul-2002; LatestRevisionNote: Re-released for DXP Platform.; Publisher: Altium Limited
P3 = Header 20: 'Wafer Header, 20-Pin,white; LatestRevisionDate: 17-Jul-2002; LatestRevisionNote: Re-released for DXP Platform.; Publisher: Altium Limited
P4 = Header 3: 'Wafer Header, 3-Pin,white; LatestRevisionDate: 17-Jul-2002; LatestRevisionNote: Re-released for DXP Platform.; Publisher: Altium Limited
R139-R150 = Res1: Resistor; Value: 10K; Published: 8-Jun-2000; LatestRevisionDate: 17-Jul-2002; LatestRevisionNote: Re-released for DXP Platform.; PackageReference: AXIAL-0.3; Publisher: Altium Limited
R152-R156 R159 = Res1: Resistor; Published: 8-Jun-2000; LatestRevisionDate: 17-Jul-2002; LatestRevisionNote: Re-released for DXP Platform.; PackageReference: AXIAL-0.3; Publisher: Altium Limited; Value: 10K
U24 U25 = HCPL-2601/2611: Hight Speed 10Mbit/s Logic Gate Optocoupler
U26 = PCA82C250/251: CAN controller bus transceiver
U27 = MAX232ESE: +5V Powered, Multi-Channel RS-232 Driver/Receiver; Published: 16-Jan-2001; LatestRevisionDate: 13-Apr-2006; LatestRevisionNote: IPC-7351 Footprint Added.; PackageReference: NSO16; Publisher: Altium Limited; PackageDescription: 16-Pin Small Outline Integrated Circuit 1.27 mm Pitch; Code_JEDEC: MS-012-AC; Code_IPC: SOIC127P600-16; ComponentLink1Description: Manufacturer Link; ComponentLink1URL: http://www.maxim-ic.com/; ComponentLink2Description: Datasheet; ComponentLink2URL: http://pdfserv.maxim-ic.com/en/ds/MAX220-MAX249.pdf
U28 = LM1117T-5.0: 800mA Low-Dropout Linear Regulator

## Nets that join several sheets
3.3V: cpu (27 pins), xcomm (8 pins)
5V: cpu (20 pins), input1 (R54.2 R55.2 R56.1), input2 (R75.1 R76.1 R77.2 R78.2), input3 (R97.1 R98.1 R99.2 R100.2), output1 (Q8.2 Q9.2 R3.1 R6.1), output2 (R124.1 R125.1 R129.1), output3 (R132.1 R136.1 R161.1 R162.1), xcomm (6 pins)
12V: input1 (12 pins), input2 (9 pins), input3 (9 pins), output1 (9 pins), output2 (R126.2 R127.2 R130.2), output3 (R133.2 R134.1 R137.2 R138.1), xcomm (C41.2 P3.8 U28.3)
GND: cpu (51 pins), input1 (U8.3 U9.3), input2 (U11.3 U12.3), input3 (U14.3 U15.3), output1 (U16.2 U17.2), output2 (Q12.2 Q13.2 Q14.2), output3 (Q15.2 Q16.2 Q17.2 Q18.2), xcomm (8 pins)
GNDA: input1 (9 pins), input2 (7 pins), input3 (7 pins), output1 (7 pins), output2 (U19.3 U20.3 U21.3), output3 (U22.3 U23.3), xcomm (12 pins)
CAN_LED_ERR: cpu (U1.36), output3 (R160.1)
CAN_LED_RUN: cpu (U1.35), output3 (R158.1)
CAN_RD1: cpu (U1.37), xcomm (R139.2 U25.6)
CAN_TD1: cpu (U1.38), xcomm (R159.2 U24.3)
JTAG_TCK: cpu (U1.5), xcomm (P1.9 R155.1)
JTAG_TDI: cpu (U1.2), xcomm (P1.5 R153.1)
JTAG_TDO: cpu (U1.1), xcomm (P1.6 R156.1)
JTAG_TMS: cpu (U1.3), xcomm (P1.7 R152.1)
JTAG_TRST: cpu (U1.4), xcomm (P1.3 R154.1)
LEVEL_HIGH1: cpu (U1.28), input2 (R79.2)
LEVEL_HIGH2: cpu (U1.30), input3 (R101.2)
LEVEL_HIGHT1_PORT: input2 (R59.1 R61.2), xcomm (P3.14)
LEVEL_HIGHT2_PORT: input3 (R81.1 R83.2), xcomm (P3.16)
LEVEL_LOW1: cpu (U1.29), input2 (R80.2)
LEVEL_LOW1_PORT: input2 (R60.1 R62.2), xcomm (P3.15)
LEVEL_LOW2: cpu (U1.31), input3 (R102.2)
LEVEL_LOW2_PORT: input3 (R82.1 R84.2), xcomm (P3.17)
MCU_RXD0: cpu (U1.80), xcomm (R149.1)
MCU_TXD0: cpu (U1.79), xcomm (R148.1)
PLUS_IN_CAP: cpu (U1.32), input1 (R57.2)
PLUS_IN_PORT: input1 (R1.1 R40.2), xcomm (P3.13)
PLUS_POWER_PORT: input1 (D3.2), xcomm (P3.12)
RELAY_L1: cpu (U1.70), output3 (R131.1)
RELAY_L1_PORT: output3 (D17.2 R133.1 U22.4), xcomm (P3.2)
RELAY_L2: cpu (U1.69), output3 (R135.1)
RELAY_L2_PORT: output3 (D18.2 R137.1 U23.4), xcomm (P3.1)
RELAY_M1: cpu (U1.76), output1 (R103.1)
RELAY_M1_PORT: output1 (R107.1 U16.4), xcomm (P3.7)
RELAY_M2: cpu (U1.75), output1 (R104.1)
RELAY_M2_PORT: output1 (R35.1 R36.2 R108.1 U17.4), xcomm (P3.6)
RELAY_S1: cpu (U1.73), output2 (R122.1)
RELAY_S1_PORT: output2 (R126.1 U19.4), xcomm (P3.5)
RELAY_S2: cpu (U1.72), output2 (R128.1)
RELAY_S2_PORT: output2 (R130.1 U21.4), xcomm (P3.4)
RELAY_S3: cpu (U1.71), output2 (R123.1)
RELAY_S3_PORT: output2 (R127.1 U20.4), xcomm (P3.3)
RMT_DEBUG: cpu (U1.27), input1 (R58.2)
RMT_DEBUG_PORT: input1 (R39.1 R41.2), xcomm (P3.18)
SYS_RESET: cpu (R4.1 U1.14 U6.2), xcomm (P1.4)